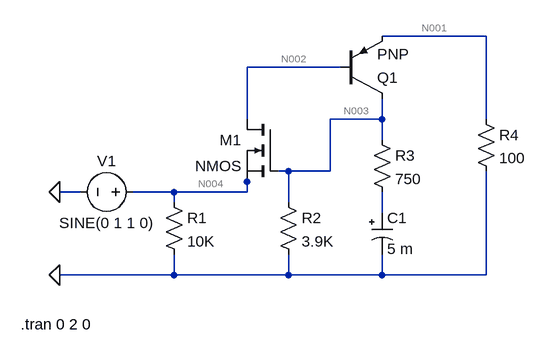
[diagram p0: schematic preamp.asc]
preamp.asc, the LTspice schematic file:
Version 4
SHEET 1 880 680
WIRE 544 64 384 64
WIRE 320 112 176 112
WIRE 176 192 176 112
WIRE 384 192 384 160
WIRE 384 192 304 192
WIRE 544 192 544 64
WIRE 384 224 384 192
WIRE 240 272 224 272
WIRE 304 272 304 192
WIRE 304 272 240 272
WIRE 176 288 176 272
WIRE -80 304 -112 304
WIRE 64 304 0 304
WIRE 176 304 176 288
WIRE 176 304 64 304
WIRE 64 320 64 304
WIRE 240 320 240 272
WIRE 384 336 384 304
WIRE 64 432 64 400
WIRE 64 432 -112 432
WIRE 240 432 240 400
WIRE 240 432 64 432
WIRE 384 432 384 400
WIRE 384 432 240 432
WIRE 544 432 544 272
WIRE 544 432 384 432
FLAG -112 432 0
FLAG -112 304 0
SYMBOL voltage 16 304 R90
WINDOW 0 -32 56 VBottom 0
WINDOW 3 32 56 VTop 0
WINDOW 123 0 0 Left 0
WINDOW 39 0 0 Left 0
SYMATTR InstName V1
SYMATTR Value SINE(0 1 1 0)
SYMBOL res 48 304 R0
SYMATTR InstName R1
SYMATTR Value 10K
SYMBOL nmos 224 192 M0
SYMATTR InstName M1
SYMBOL res 224 304 R0
SYMATTR InstName R2
SYMATTR Value 3.9K
SYMBOL res 368 208 R0
SYMATTR InstName R3
SYMATTR Value 750
SYMBOL polcap 368 336 R0
SYMATTR InstName C1
SYMATTR Value 5 m
SYMBOL pnp 320 160 M180
SYMATTR InstName Q1
SYMBOL res 528 176 R0
SYMATTR InstName R4
SYMATTR Value 100
TEXT -172 508 Left 0 !.tran 0 2 0

The netlist it stands for:
* preamp.asc
V1 N004 0 SINE(0 1 1 0)
R1 N004 0 10K
M1 N002 N003 N004 N004 NMOS
R2 N003 0 3.9K
R3 N003 N005 750
C1 N005 0 5 m
Q1 N003 N002 N001 0 PNP
R4 N001 0 100
.model NPN NPN
.model PNP PNP
.lib standard.bjt
.model NMOS NMOS
.model PMOS PMOS
.lib standard.mos
.tran 0 2 0
.backanno
.end

* Results of the author's LTspice run, read from the files saved beside the schematic
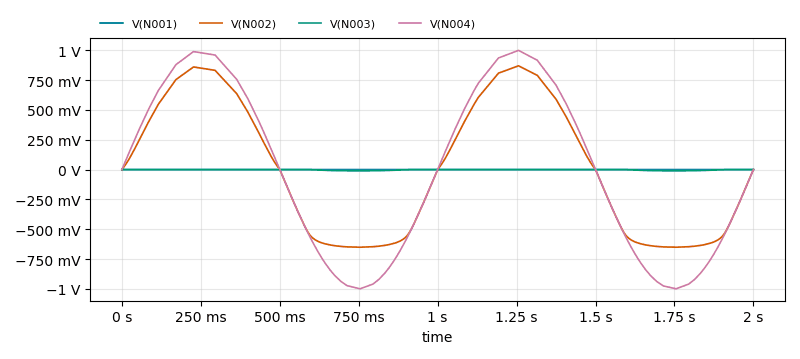
[diagram p1: Transient Analysis of preamp.asc, plotted from the saved traces]
* Transient Analysis, 1 run:
*   V(N001): min -289.8 µV, max 179.5 pV, average -44.65 µV, rms 98.35 µV, last 0 V
*   V(N002): min -651 mV, max 869.8 mV, average 13.58 mV, rms 566.5 mV, last 90.11 nV
*   V(N003): min -10.84 mV, max 765 nV, average -2.342 mV, rms 4.544 mV, last 0 V
*   V(N004): min -999.6 mV, max 999.3 mV, average -2.523 mV, rms 704 mV, last 0 V